# Altium schematic sheet Control_part.SchDoc
size 420 x 297 mm; SheetNumber: 4
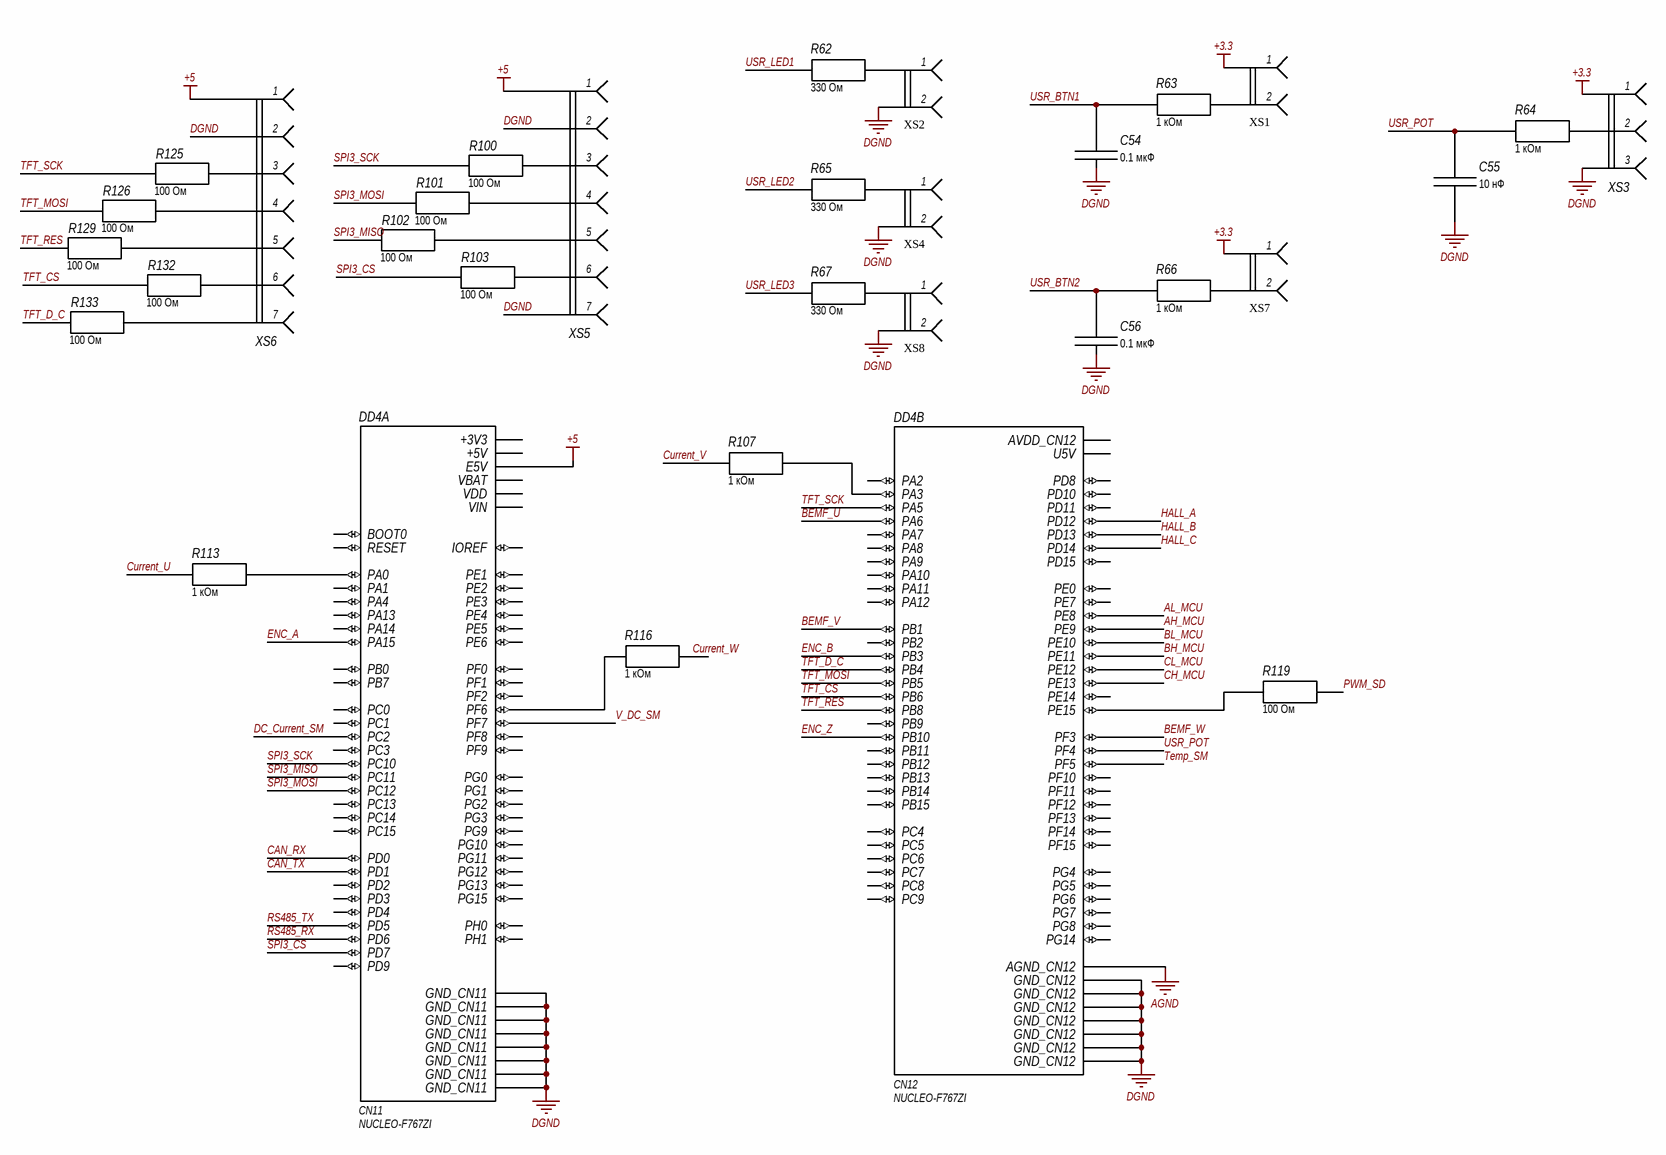
[diagram p0: Control_part.SchDoc]

## Parts
C54  value 0.1 мкФ  [CC0603]  (hidden comment: Capacitor)
C55  value 10 нФ  [CC0603]  (hidden comment: Capacitor)
C56  value 0.1 мкФ  [CC0603]  (hidden comment: Capacitor)
DD4  NUCLEO-F767ZI  [ST_NUCLEO-F767ZI]  (parts A,B of 6)
R62  value 330 Ом  [RC1206]  (hidden comment: Resistor)
R63  value 1 кОм  [RC0603]  (hidden comment: Resistor)
R64  value 1 кОм  [RC0603]  (hidden comment: Resistor)
R65  value 330 Ом  [RC1206]  (hidden comment: Resistor)
R66  value 1 кОм  [RC0603]  (hidden comment: Resistor)
R67  value 330 Ом  [RC1206]  (hidden comment: Resistor)
R100  value 100 Ом  [RC0603]  (hidden comment: Resistor)
R101  value 100 Ом  [RC0603]  (hidden comment: Resistor)
R102  value 100 Ом  [RC0603]  (hidden comment: Resistor)
R103  value 100 Ом  [RC0603]  (hidden comment: Resistor)
R107  value 1 кОм  [RC0603]  (hidden comment: Resistor)
R113  value 1 кОм  [RC0603]  (hidden comment: Resistor)
R116  value 1 кОм  [RC0603]  (hidden comment: Resistor)
R119  value 100 Ом  [RC0603]  (hidden comment: Resistor)
R125  value 100 Ом  [RC0603]  (hidden comment: Resistor)
R126  value 100 Ом  [RC0603]  (hidden comment: Resistor)
R129  value 100 Ом  [RC0603]  (hidden comment: Resistor)
R132  value 100 Ом  [RC0603]  (hidden comment: Resistor)
R133  value 100 Ом  [RC0603]  (hidden comment: Resistor)
XS1  JST-Male-2  [JST-2]  (value not drawn)
XS2  JST-Male-2  [JST-2]  (value not drawn)
XS3  JST-Male-3  [JST-3]  (value not drawn)
XS4  JST-Male-2  [JST-2]  (value not drawn)
XS5  JST-Male-7  [JST-7]  (value not drawn)
XS6  JST-Male-7  [JST-7]  (value not drawn)
XS7  JST-Male-2  [JST-2]  (value not drawn)
XS8  JST-Male-2  [JST-2]  (value not drawn)

## Nets
+3.3: XS1.1 XS3.1 XS7.1
+5: DD4.CN11_6(E5V) XS5.1 XS6.1
AGND: DD4.CN12_32(AGND_CN12)
DGND: C54.1 C55.1 C56.1 DD4.CN11_8(GND_CN11) DD4.CN11_19(GND_CN11) DD4.CN11_20(GND_CN11) DD4.CN11_22(GND_CN11) DD4.CN11_49(GND_CN11) DD4.CN11_60(GND_CN11) DD4.CN11_71(GND_CN11) DD4.CN11_72(GND_CN11) DD4.CN12_9(GND_CN12) DD4.CN12_20(GND_CN12) DD4.CN12_39(GND_CN12) DD4.CN12_54(GND_CN12) DD4.CN12_63(GND_CN12) DD4.CN12_71(GND_CN12) DD4.CN12_72(GND_CN12) XS2.2 XS3.3 XS4.2 XS5.2 XS5.7 XS6.2 XS8.2
AH_MCU: DD4.CN12_52(PE9)
AL_MCU: DD4.CN12_40(PE8)
BEMF_U: DD4.CN12_13(PA6)
BEMF_V: DD4.CN12_24(PB1)
BEMF_W: DD4.CN12_58(PF3)
BH_MCU: DD4.CN12_56(PE11)
BL_MCU: DD4.CN12_47(PE10)
CAN_RX: DD4.CN11_57(PD0)
CAN_TX: DD4.CN11_55(PD1)
CH_MCU: DD4.CN12_55(PE13)
CL_MCU: DD4.CN12_49(PE12)
Current_U: R113.1
Current_V: R107.1
Current_W: R116.1
DC_Current_SM: DD4.CN11_35(PC2)
ENC_A: DD4.CN11_17(PA15)
ENC_B: DD4.CN12_31(PB3)
ENC_Z: DD4.CN12_25(PB10)
HALL_A: DD4.CN12_43(PD12)
HALL_B: DD4.CN12_41(PD13)
HALL_C: DD4.CN12_46(PD14)
PWM_SD: R119.1
RS485_RX: DD4.CN11_43(PD6)
RS485_TX: DD4.CN11_41(PD5)
SPI3_CS: DD4.CN11_45(PD7) R103.2
SPI3_MISO: DD4.CN11_2(PC11) R102.2
SPI3_MOSI: DD4.CN11_3(PC12) R101.2
SPI3_SCK: DD4.CN11_1(PC10) R100.2
Temp_SM: DD4.CN12_36(PF5)
TFT_CS: DD4.CN12_17(PB6) R132.2
TFT_D_C: DD4.CN12_27(PB4) R133.2
TFT_MOSI: DD4.CN12_29(PB5) R126.2
TFT_RES: DD4.CN12_3(PB8) R129.2
TFT_SCK: DD4.CN12_11(PA5) R125.2
USR_BTN1: C54.2 R63.1
USR_BTN2: C56.2 R66.1
USR_LED1: R62.1
USR_LED2: R65.1
USR_LED3: R67.1
USR_POT: C55.2 DD4.CN12_38(PF4) R64.1
V_DC_SM: DD4.CN11_11(PF7)
NetDD4_CN11_9: DD4.CN11_9(PF6) R116.2
NetDD4_CN11_28: DD4.CN11_28(PA0) R113.2
NetDD4_CN12_37: DD4.CN12_37(PA3) R107.2
NetDD4_CN12_53: DD4.CN12_53(PE15) R119.2
NetR62_2: R62.2 XS2.1
NetR63_2: R63.2 XS1.2
NetR64_2: R64.2 XS3.2
NetR65_2: R65.2 XS4.1
NetR66_2: R66.2 XS7.2
NetR67_2: R67.2 XS8.1
NetR100_1: R100.1 XS5.3
NetR101_1: R101.1 XS5.4
NetR102_1: R102.1 XS5.5
NetR103_1: R103.1 XS5.6
NetR125_1: R125.1 XS6.3
NetR126_1: R126.1 XS6.4
NetR129_1: R129.1 XS6.5
NetR132_1: R132.1 XS6.6
NetR133_1: R133.1 XS6.7

Not connected (* = marked no-connect by the designer): DD4 CN11_4(PD2) CN11_5(VDD) CN11_7(BOOT0) CN11_12(IOREF) CN11_13(PA13) CN11_14(RESET) CN11_15(PA14) CN11_16(+3V3) CN11_18(+5V) CN11_21(PB7) CN11_23(PC13) CN11_24(VIN) CN11_25(PC14) CN11_27(PC15) CN11_29(PH0) CN11_30(PA1) CN11_31(PH1) CN11_32(PA4) CN11_33(VBAT) CN11_34(PB0) CN11_36(PC1) CN11_37(PC3) CN11_38(PC0) CN11_39(PD4) CN11_40(PD3) CN11_42(PG2) CN11_44(PG3) CN11_46(PE2) CN11_47(PE3) CN11_48(PE4) CN11_50(PE5) CN11_51(PF1) CN11_52(PF2) CN11_53(PF0) CN11_54(PF8) CN11_56(PF9) CN11_58(PG1) CN11_59(PG0) CN11_61(PE1) CN11_62(PE6) CN11_63(PG9) CN11_64(PG15) CN11_65(PG12) CN11_66(PG10) CN11_68(PG13) CN11_69(PD9) CN11_70(PG11) CN12_1(PC9) CN12_2(PC8) CN12_4(PC6) CN12_5(PB9) CN12_6(PC5) CN12_7(AVDD_CN12) CN12_8(U5V) CN12_10(PD8) CN12_12(PA12) CN12_14(PA11) CN12_15(PA7) CN12_16(PB12) CN12_18(PB11) CN12_19(PC7) CN12_21(PA9) CN12_22(PB2) CN12_23(PA8) CN12_26(PB15) CN12_28(PB14) CN12_30(PB13) CN12_33(PA10) CN12_34(PC4) CN12_35(PA2) CN12_42(PF10) CN12_44(PE7) CN12_45(PD11) CN12_48(PD15) CN12_50(PF14) CN12_51(PE14) CN12_57(PF13) CN12_59(PF12) CN12_60(PF15) CN12_61(PG14) CN12_62(PF11) CN12_64(PE0) CN12_65(PD10) CN12_66(PG8) CN12_67(PG7) CN12_68(PG5) CN12_69(PG4) CN12_70(PG6)

## Notes on the sheet
- Подп. и дата
- Инв. № дубл.
- Взам. инв. №
- Инв. № подл.
- Изм.
- Лист
- № докум.
- Подп.
- Дата
- Форма 2а ГОСТ 2.104-2006
- Копировал
- Формат А3
- (in symbol NUCLEO-F767ZI, part A) CN11
- (in symbol NUCLEO-F767ZI, part B) CN12

## Library data of the parts
C54-C56 = Capacitor: Voltage: 50 В; ComponentLink1Description: Product link; ComponentLink1URL: *; Name: CC0603; GOST_Name_1: =Name; GOST_Name_2: 50 В; GOST_Name_0: -
  C54 C56: GOST_Name_3: 0.1 мкФ
  C55: GOST_Name_3: 10 нФ
DD4 = NUCLEO-F767ZI: STM32 Nucleo-144 development board with STM32F767ZI MCU, supports Arduino, ST Zio and morpho connectivity; MP: NUCLEO-F429ZI; MF: STMicroelectronics; Name: NUCLEO-F429ZI, ф. STMicroelectronics; Package: None; Price: None; Value: *; Availability: Unavailable; GOST_Name_1: NUCLEO-F429ZI, ф. STMicroelectronics
R62 R65 R67 = Resistor: Power: 250 мВт; ComponentLink1Description: Product link; ComponentLink1URL: *; Name: RC1206; GOST_Name_1: =Name; GOST_Name_2: 250 мВт; GOST_Name_3: 330 Ом; GOST_Name_0: -
R63 R64 R66 R100-R103 R107 R113 R116 R119 R125 R126 R129 R132 R133 = Resistor: Power: 100 мВт; ComponentLink1Description: Product link; ComponentLink1URL: *; Name: RC0603; GOST_Name_1: =Name; GOST_Name_2: 100 мВт; GOST_Name_0: -
  R63 R64 R66 R107 R113 R116: GOST_Name_3: 1 кОм
  R100-R103 R119 R125 R126 R129 R132 R133: GOST_Name_3: 100 Ом
XS1 XS2 XS4 XS7 XS8 = JST-Male-2: Name: JST-2.54 x2; GOST_Name_1: JST-2.54 x2
XS3 = JST-Male-3: Name: JST-2.54 x3
XS5 XS6 = JST-Male-7: Name: JST-2.54 x7; GOST_Name_1: JST-2.54 x7